# EAGLE design booster (EAGLE 5.12)
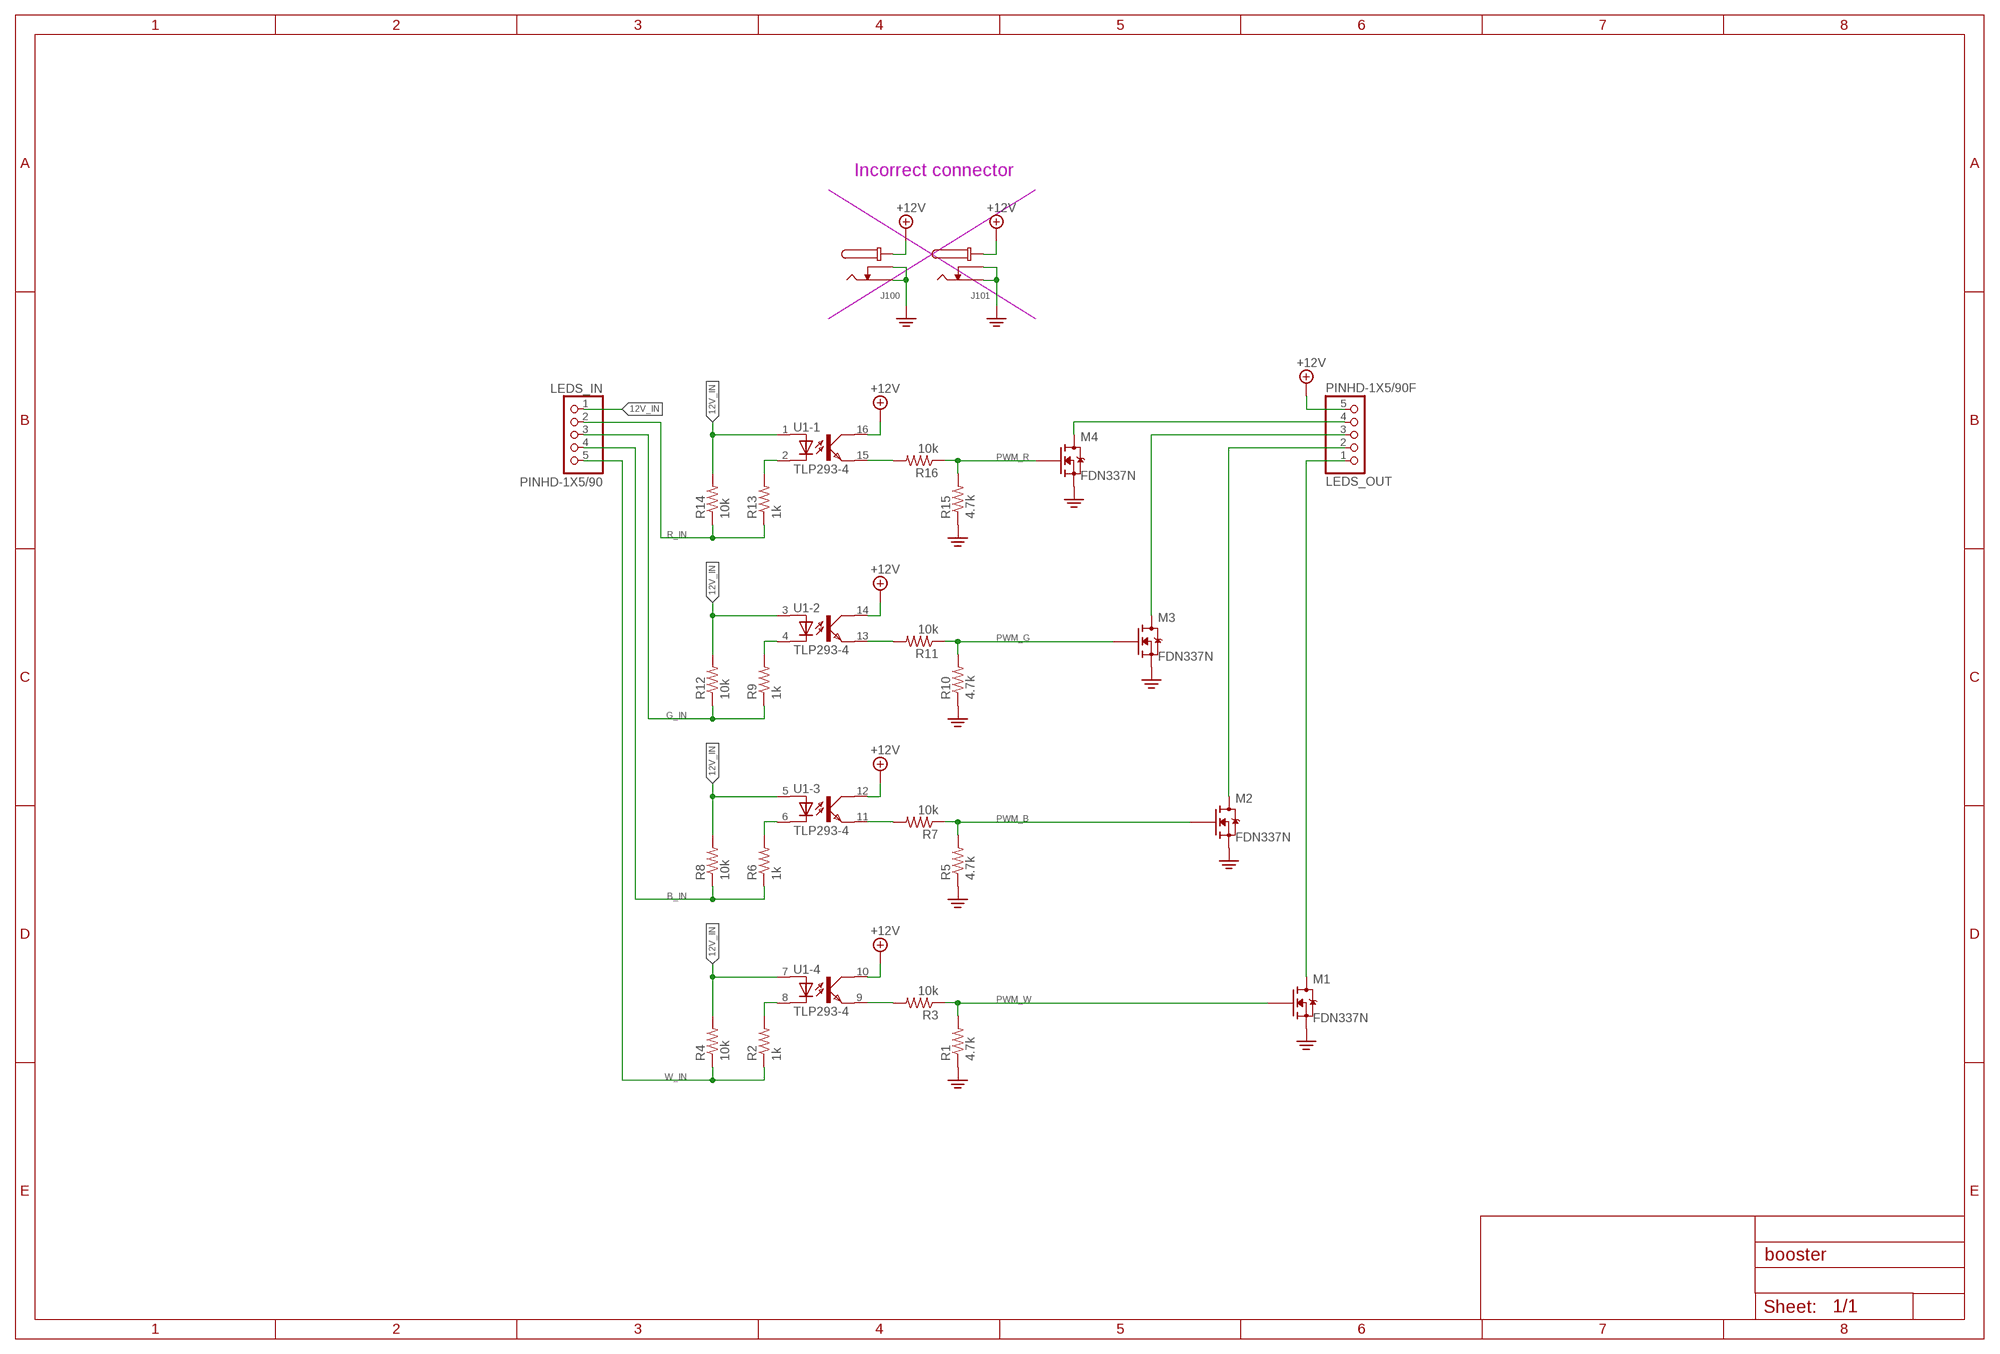
[diagram p0: schematic, sheet 1]

## Parts
J100  EIAJ-03  [PJ1-021-SMD]
J101  EIAJ-03  [PJ1-021-SMD]
LEDS_IN  PINHD-1X5/90  [1X05/90]
LEDS_OUT  PINHD-1X5/90F  [1X05/90-F]
M1  FDN337N  [SOT23]
M2  FDN337N  [SOT23]
M3  FDN337N  [SOT23]
M4  FDN337N  [SOT23]
R1  4.7k  R-0603  [0603]
R2  1k  R-0402  [0402]
R3  10k  R-0402  [0402]
R4  10k  R-0402  [0402]
R5  4.7k  R-0603  [0603]
R6  1k  R-0402  [0402]
R7  10k  R-0402  [0402]
R8  10k  R-0402  [0402]
R9  1k  R-0402  [0402]
R10  4.7k  R-0603  [0603]
R11  10k  R-0402  [0402]
R12  10k  R-0402  [0402]
R13  1k  R-0402  [0402]
R14  10k  R-0402  [0402]
R15  4.7k  R-0603  [0603]
R16  10k  R-0402  [0402]
U1  TLP293-4  [SOIC16N]

## Nets
12V: J100.1(CENTER) J101.1(CENTER) LEDS_OUT.5 U1.10(-4:COL) U1.12(-3:COL) U1.14(-2:COL) U1.16(-1:COL) ; supply symbol labelled +12V
12V_IN: LEDS_IN.1 R4.2 R8.2 R12.2 R14.2 U1.1(-1:A) U1.3(-2:A) U1.5(-3:A) U1.7(-4:A)
B_IN: LEDS_IN.4 R6.1 R8.1
G_IN: LEDS_IN.3 R9.1 R12.1
GND: J100.2(OUTSIDE) J100.3(SW) J101.2(OUTSIDE) J101.3(SW) M1.2(S) M2.2(S) M3.2(S) M4.2(S) R1.1 R5.1 R10.1 R15.1
N$1: R13.2 U1.2(-1:C)
N$2: R9.2 U1.4(-2:C)
N$3: R11.2 U1.13(-2:EMIT)
N$4: R16.2 U1.15(-1:EMIT)
N$5: R6.2 U1.6(-3:C)
N$6: R7.2 U1.11(-3:EMIT)
N$7: R2.2 U1.8(-4:C)
N$8: R3.2 U1.9(-4:EMIT)
N$16: LEDS_OUT.1 M1.3(D)
N$17: LEDS_OUT.2 M2.3(D)
N$18: LEDS_OUT.3 M3.3(D)
N$19: LEDS_OUT.4 M4.3(D)
PWM_B: M2.1(G) R5.2 R7.1
PWM_G: M3.1(G) R10.2 R11.1
PWM_R: M4.1(G) R15.2 R16.1
PWM_W: M1.1(G) R1.2 R3.1
R_IN: LEDS_IN.2 R13.1 R14.1
W_IN: LEDS_IN.5 R2.1 R4.1

## Notes on the sheet
- Incorrect connector

## Library data of the parts
J100 J101 = aim-connectors:EIAJ-03: EIAJ-03 Jack
LEDS_IN LEDS_OUT = aim-headers:PINHD-1X5: PIN HEADER
M1-M4 = aim-transistor:FDN337N
R1-R16 = aim-passives:R
U1 = aim-transistor:TLP293-4

## Board
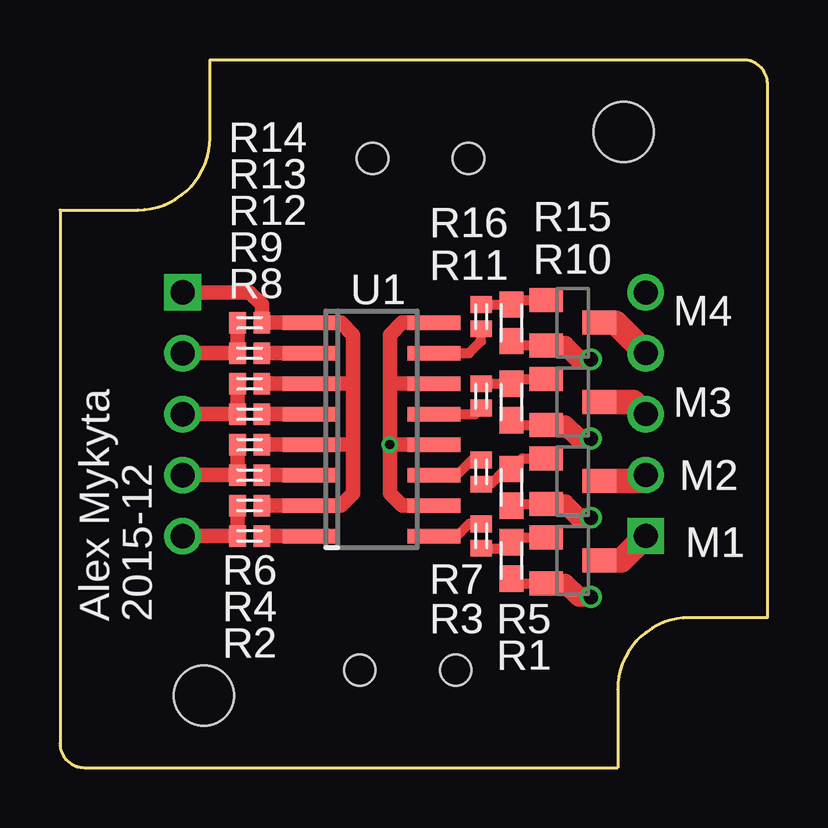
[diagram p1: board, top side]
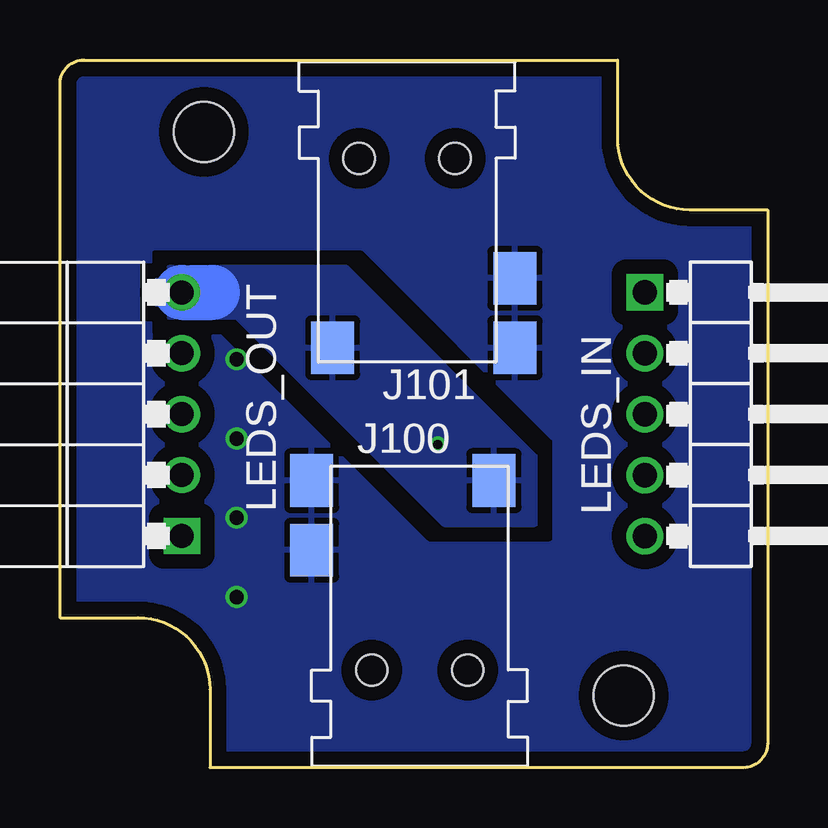
[diagram p2: board, bottom side, seen from below]

Size 29.5 x 29.5 mm. Coordinates in mm from the lower left corner, seen from the top.
Copper layers (1*16): Top 0.035mm / dielectric 1.5mm / Bottom 0.035mm
Design rules "MakerStudio": minimum track width 6mil, minimum drill 12mil, track to track 6mil, track to pad 6mil, pad to pad 6mil, via to via 6mil, smd to smd 0mil, copper to edge 10mil, drill to drill 10mil, minimum pad ring 10mil, minimum via ring 6mil, stop-mask expansion 2mil, vias tented up to drill 100mil, thermal gap 10mil

### Footprints (pad centres in the part's own frame; a part is rotated, then mirrored left to right if it is on the bottom)
PJ1-021-SMD = smd 2.2 x 1.8: 1 7.9,-2.6; 2 5,5; 3 7.9,5 | hole 1.3: 0,2.5; 0,-1.5
1X05/90 = drill 1.016 square: 1 -5.08,-3.81 | drill 1.016 round: 2 -2.54,-3.81; 3 0,-3.81; 4 2.54,-3.81; 5 5.08,-3.81
1X05/90-F = drill 1 square: 1 -5.08,0 | drill 1 round: 2 -2.54,0; 3 0,0; 4 2.54,0; 5 5.08,0
SOT23 = smd 1 x 1.4: 1 -0.95,-1.1; 2 0.95,-1.1; 3 0,1.1
0603 = smd 1.1 x 1: 1 -0.762,0; 2 0.762,0
0402 = smd 0.7 x 0.9: 1 -0.508,0; 2 0.508,0
SOIC16N = smd 0.6 x 2.2: 1 -4.445,-2.6; 2 -3.175,-2.6; 3 -1.905,-2.6; 4 -0.635,-2.6; 5 0.635,-2.6; 6 1.905,-2.6; 7 3.175,-2.6; 8 4.445,-2.6; 9 4.445,2.6; 10 3.175,2.6; 11 1.905,2.6; 12 0.635,2.6; 13 -0.635,2.6; 14 -1.905,2.6; 15 -3.175,2.6; 16 -4.445,2.6
1551NFL = hole 2.5: 6,26.5; 23.5,3

### Placement (x,y rotation side)
J100  14.01,4.06 90 bottom
J101  15.53,25.4 270 bottom
LEDS_IN  1.31,14.73 270 bottom
LEDS_OUT  24.42,14.73 90 bottom
M1  21.37,8.64 270 top
M2  21.37,11.94 270 top
M3  21.37,15.24 270 top
M4  21.37,18.54 270 top
R1  18.83,8.64 90 top
R2  7.91,9.65 0 top
R3  17.56,9.65 90 top
R4  7.91,10.92 0 top
R5  18.83,11.68 90 top
R6  7.91,12.19 0 top
R7  17.56,12.32 90 top
R8  7.91,13.46 0 top
R9  7.91,14.73 0 top
R10  18.83,15.24 90 top
R11  17.56,15.49 270 top
R12  7.91,16 0 top
R13  7.91,17.27 0 top
R14  7.91,18.54 0 top
R15  18.83,18.54 90 top
R16  17.56,18.8 270 top
U1  12.99,14.1 270 top
U$12  [1551NFL]  29.5,0 0 bottom

### Tracks (layer width: path | path; a pad name or v marks a point on that pad's centre or on a via)
12V  (via drill 0.38)
  Top 0.61: U1.10 14.26,10.92 13.75,11.43 v13.75,13.46 | v13.75,13.46 U1.12 | v13.75,13.46 13.75,16 | 13.75,16 U1.14 | 13.75,16 13.75,18.03 14.26,18.54 U1.16
  Bottom 2.286: LEDS_OUT.5 23.15,19.81
  pour Bottom: 9.69,10.16 9.69,12.95 17.56,20.83 24.93,20.83 25.44,20.32 25.44,19.3 24.93,18.8 22.13,18.8 13.5,10.16
12V_IN
  Top 0.61: R12.2 U1.3 12.23,16 | R4.2 U1.7 11.72,10.92 12.23,11.43 12.23,13.46 | 12.23,13.46 12.23,16 | 12.23,13.46 U1.5 R8.2 | 12.23,16 12.23,18.03 11.72,18.54 U1.1 R14.2 8.42,19.3 7.91,19.81 LEDS_IN.1
B_IN
  Top 0.61: LEDS_IN.4 R6.1 R8.1
G_IN
  Top 0.61: LEDS_IN.3 R9.1 R12.1
GND  (via drill 0.6)
  Top 0.406: M3.2 19.02,14.29 R10.1 | M4.2 19.02,17.59 R15.1 | M2.2 18.9,10.99 R5.1 | M1.2 19.02,7.69 R1.1
  Top 0.813: M3.2 21.05,14.29 21.63,13.72 v22.13,13.72 | M4.2 21.05,17.59 21.63,17.02 v22.13,17.02 | M2.2 21.05,10.99 21.63,10.41 v22.13,10.41 | M1.2 21.05,7.69 21.63,7.11 v22.13,7.11
  pour Bottom (isolate 0.61, rank 2): 0.04,29.46 29.5,29.46 29.5,0 0.04,0
N$1
  Top 0.61: R13.2 U1.2
N$2
  Top 0.61: R9.2 U1.4
N$3
  Top 0.406: U1.13 17.31,14.73 R11.2
N$4
  Top 0.406: U1.15 17.05,17.27 17.56,17.78 R16.2
N$5
  Top 0.61: R6.2 U1.6
N$6
  Top 0.406: U1.11 16.55,12.19 17.18,12.83 R7.2
N$7
  Top 0.61: R2.2 U1.8
N$8
  Top 0.406: U1.9 16.55,9.65 17.05,10.16 R3.2
N$16
  Top 1.016: M1.3 23.4,8.64 LEDS_OUT.1
N$17
  Top 1.016: M2.3 24.17,11.94 LEDS_OUT.2
N$18
  Top 1.016: M3.3 23.91,15.24 LEDS_OUT.3
N$19
  Top 1.016: M4.3 23.15,18.54 LEDS_OUT.4
PWM_B
  Top 0.406: M2.1 19.27,12.89 R5.2 18.58,12.45 17.94,11.81 R7.1
PWM_G
  Top 0.406: R11.1 R10.2 19.02,16.19 M3.1
PWM_R
  Top 0.406: M4.1 19.02,19.49 R15.2 R16.1
PWM_W
  Top 0.406: M1.1 19.02,9.59 R1.2 18.58,9.14 R3.1
R_IN
  Top 0.61: LEDS_IN.2 R13.1 R14.1
W_IN
  Top 0.61: LEDS_IN.5 R2.1 R4.1

### Text on the board
_tPlace: Alex Mykyta | 2015-12
_tNames: R14 | R13 | R12 | R16 | R15 | R9 | R10 | R8 | R11 | U1 | M4 | M3 | M2 | R7 | M1 | R6 | R3 | R4 | R5 | R2 | R1
_bNames: LEDS_IN | J101 | J100 | LEDS_OUT